# Altium project FlightControlBoard.PrjPcb
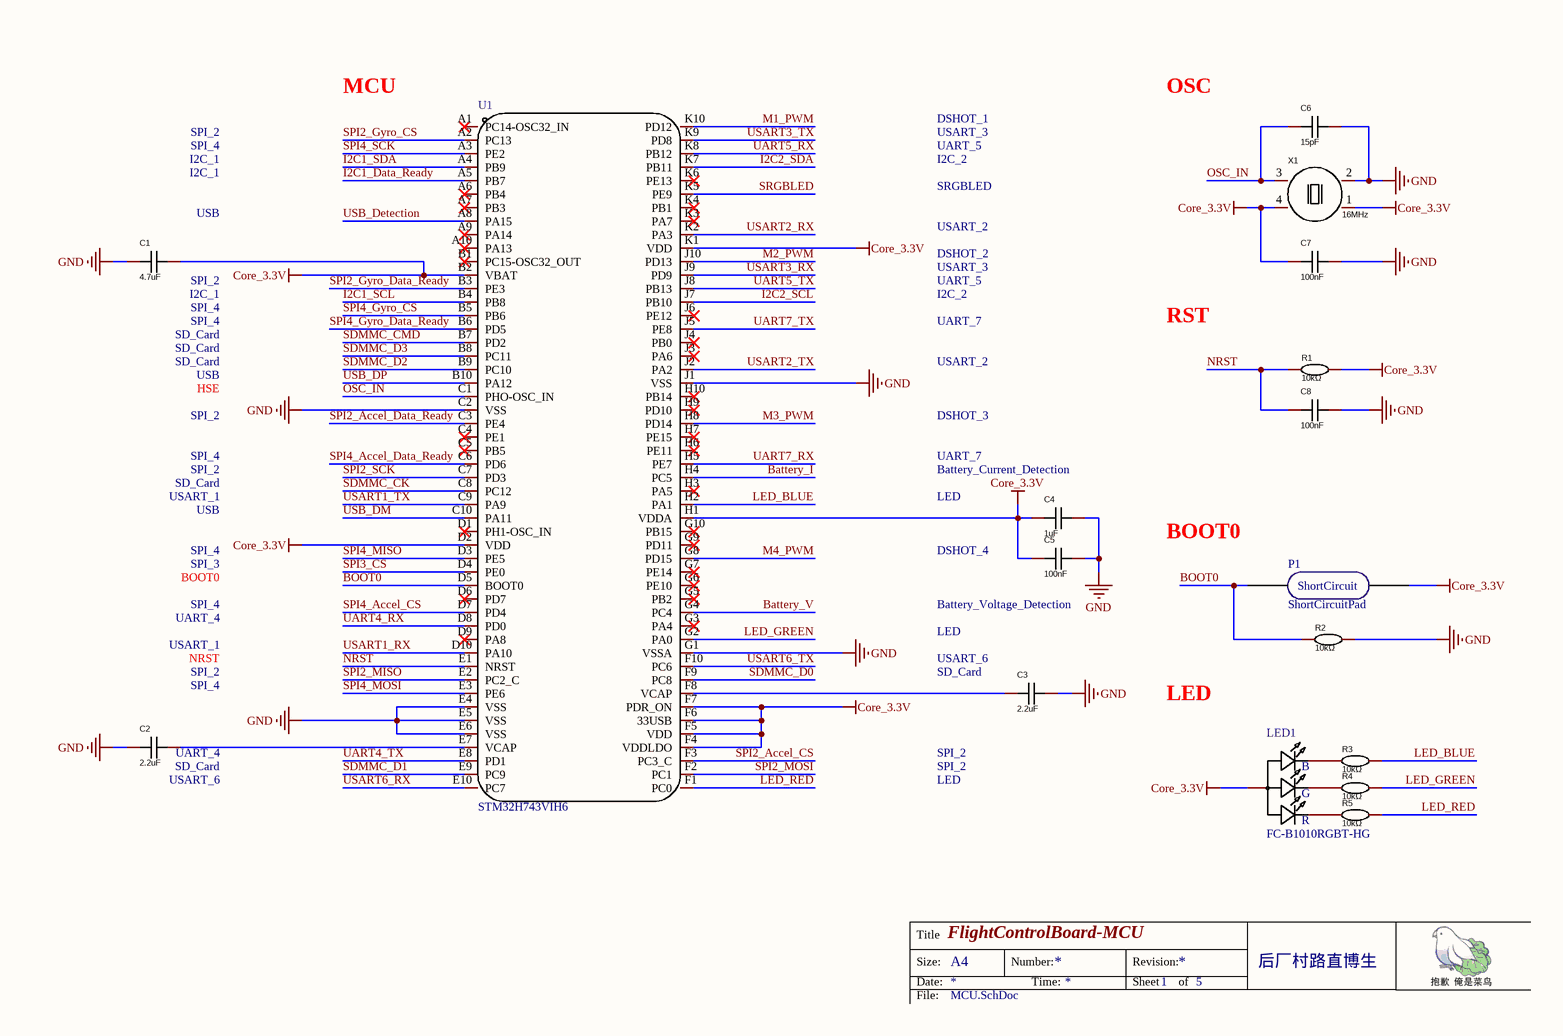
[diagram p0: MCU.SchDoc]
5 sheets, 249 parts. Net scope: global (net labels, ports and power ports of the same name join across sheets).
Board file: FlightControlBoard.PcbDoc
Sheets:
  MCU.SchDoc
  ESC.SchDoc
  Peripheral.SchDoc
  Power.SchDoc
  Interface.SchDoc

## Sheet MCU.SchDoc: FlightControlBoard-MCU
size A4; SheetNumber: 1; SheetTotal: 5

### Parts
C1  4.7uF  [C0402]
C2  2.2uF  [C0402]
C3  2.2uF  [C0402]
C4  1uF  [C0201]
C5  100nF  [C0201]
C6  15pF  [C0201]
C7  100nF  [C0201]
C8  100nF  [C0201]
LED1  FC-B1010RGBT-HG  [LED-ARRAY-SMD_4P-L1.0-W1.0-TR-RD]
P1  ShortCircuitPad  [ShortCircuitPad]
R1  10kΩ  [R0201]
R2  10kΩ  [R0201]
R3  10kΩ  [R0201]
R4  10kΩ  [R0201]
R5  10kΩ  [R0201]
U1  STM32H743VIH6  [BGA-100_L8.0-W8.0-P0.80-R10-C10-BL]
X1  value 16MHz  [OSC-SMD_4P-L2.5-W2.0-BL]  (hidden comment: X1G004171002700)

### Nets
Core_3.3V: C1.1 C4.2 C5.2 C7.2 LED1.1(+) P1.2 R1.2 U1.A8(PA15) U1.B2(VBAT) U1.D2(VDD) U1.F4(VDDLDO) U1.F5(VDD) U1.F6(33USB) U1.F7(PDR_ON) U1.H1(VDDA) U1.K1(VDD) X1.1(/ST) X1.4(VDD)  [also labelled USB_Detection]
GND: C1.2 C2.2 C3.1 C4.1 C5.1 C6.1 C7.1 C8.1 R2.2 U1.C2(VSS) U1.E4(VSS) U1.E5(VSS) U1.E6(VSS) U1.G1(VSSA) U1.J1(VSS) X1.2(GND)
Battery_I: U1.H4(PC5)
Battery_V: U1.G4(PC4)
BOOT0: P1.1 R2.1 U1.D5(BOOT0)
I2C1_Data_Ready: U1.A5(PB7)
I2C1_SCL: U1.B4(PB8)
I2C1_SDA: U1.A4(PB9)
I2C2_SCL: U1.J7(PB10)
I2C2_SDA: U1.K7(PB11)
LED_BLUE: R3.2 U1.H2(PA1)
LED_GREEN: R4.2 U1.G2(PA0)
LED_RED: R5.2 U1.F1(PC0)
M1_PWM: U1.K10(PD12)
M2_PWM: U1.J10(PD13)
M3_PWM: U1.H8(PD14)
M4_PWM: U1.G8(PD15)
NRST: C8.2 R1.1 U1.E1(NRST)
OSC_IN: C6.2 U1.C1(PHO-OSC_IN) X1.3(OUT)
SDMMC_CK: U1.C8(PC12)
SDMMC_CMD: U1.B7(PD2)
SDMMC_D0: U1.F9(PC8)
SDMMC_D1: U1.E9(PC9)
SDMMC_D2: U1.B9(PC10)
SDMMC_D3: U1.B8(PC11)
SPI2_Accel_CS: U1.F3(PC3_C)
SPI2_Accel_Data_Ready: U1.C3(PE4)
SPI2_Gyro_CS: U1.A2(PC13)
SPI2_Gyro_Data_Ready: U1.B3(PE3)
SPI2_MISO: U1.E2(PC2_C)
SPI2_MOSI: U1.F2(PC1)
SPI2_SCK: U1.C7(PD3)
SPI3_CS: U1.D4(PE0)
SPI4_Accel_CS: U1.D7(PD4)
SPI4_Accel_Data_Ready: U1.C6(PD6)
SPI4_Gyro_CS: U1.B5(PB6)
SPI4_Gyro_Data_Ready: U1.B6(PD5)
SPI4_MISO: U1.D3(PE5)
SPI4_MOSI: U1.E3(PE6)
SPI4_SCK: U1.A3(PE2)
SRGBLED: U1.K5(PE9)
UART4_RX: U1.D8(PD0)
UART4_TX: U1.E8(PD1)
UART5_RX: U1.K8(PB12)
UART5_TX: U1.J8(PB13)
UART7_RX: U1.H5(PE7)
UART7_TX: U1.J5(PE8)
USART1_RX: U1.D10(PA10)
USART1_TX: U1.C9(PA9)
USART2_RX: U1.K2(PA3)
USART2_TX: U1.J2(PA2)
USART3_RX: U1.J9(PD9)
USART3_TX: U1.K9(PD8)
USART6_RX: U1.E10(PC7)
USART6_TX: U1.F10(PC6)
USB_DM: U1.C10(PA11)
USB_DP: U1.B10(PA12)
NetC2_1: C2.1 U1.E7(VCAP)
NetC3_2: C3.2 U1.F8(VCAP)
NetLED1_2: LED1.2(-) R5.1
NetLED1_3: LED1.3(-) R4.1
NetLED1_4: LED1.4(-) R3.1

Not connected (* = marked no-connect by the designer): U1 A1(PC14-OSC32_IN)* A6(PB4)* A7(PB3)* A9(PA14)* A10(PA13)* B1(PC15-OSC32_OUT)* C4(PE1)* C5(PB5)* D1(PH1-OSC_IN)* D6(PD7)* D9(PA8)* G3(PA4)* G5(PB2)* G6(PE10)* G7(PE14)* G9(PD11)* G10(PB15)* H3(PA5)* H6(PE11)* H7(PE15)* H9(PD10)* H10(PB14)* J3(PA6)* J4(PB0)* J6(PE12)* K3(PA7)* K4(PB1)* K6(PE13)*

### Notes on the sheet
- MCU
- OSC
- I2C_1
- SPI_2
- SPI_4
- I2C_2
- UART_5
- USART_3
- DSHOT_1
- USB
- USART_2
- SRGBLED
- (near C1) SPI_2
- (near C1) SPI_4
- (near C1) I2C_1
- DSHOT_2
- SD_Card
- UART_7
- RST
- HSE
- DSHOT_3
- USART_1
- (near C4) Battery_Current_Detection
- LED
- SPI_3
- BOOT0
- DSHOT_4
- UART_4
- (near C5) Battery_Voltage_Detection
- NRST
- (near C3) SD_Card
- (near C3) USART_6
- (near C2) SD_Card
- (near C2) UART_4
- (near C2) USART_6
- Title
- Size:
- Date:
- A4
- Number:
- Time:
- Revision:
- Sheet
- of
- 后厂村路直博生
- File:
- (in symbol FC-B1010RGBT-HG) B; G; R
- (in symbol ShortCircuitPad) ShortCircuit

### Library data of the parts
C1-C8 = CC0603KRX7R9BB104: Add into BOM: yes; Convert to PCB: yes
  C1: Value: 4.7uF
  C2 C3: Value: 2.2uF
  C4: Value: 1uF
  C5 C7 C8: Value: 100nF
  C6: Value: 15pF
LED1 = FC-B1010RGBT-HG: Manufacturer: 国星光电; Add into BOM: yes; Emitted Color: RGB三色; Name: FC-B1010RGBT-HG; Symbol: FC-B1010RGBT-HG; Device: FC-B1010RGBT-HG; LCSC Part Name: RGB三色 1010RGB   金线; Supplier Part: C158099; Manufacturer Part: FC-B1010RGBT-HG; Supplier Footprint: 0404; JLCPCB Part Class: Extended Part; Datasheet: https://atta.szlcsc.com/upload/public/pdf/source/20200910/C158099_0C805F16310A4C6DB0163E8F613FF382.pdf; Supplier: LCSC; Convert to PCB: yes
R1-R5 = 0603WAF1002T5E: Add into BOM: yes; Name: 10kΩ; Convert to PCB: yes; Value: 10kΩ
U1 = STM32H743VIH6: Manufacturer: ST(意法半导体); Add into BOM: yes; Name: STM32H743VIH6; Symbol: STM32H743VIH6; Device: STM32H743VIH6; LCSC Part Name: STM32H743VIH6; Supplier Part: C964146; Manufacturer Part: STM32H743VIH6; Supplier Footprint: TFBGA-100; JLCPCB Part Class: Extended Part; Datasheet: https://atta.szlcsc.com/upload/public/pdf/source/20220307/46489B78091107FB73FE6602EFA9948C.pdf; Supplier: LCSC; Convert to PCB: yes
X1 = X1G004171002700: Manufacturer: EPSON(爱普生); Add into BOM: yes; Supply Voltage: 1.6V~3.6V; Name: 16MHz; Symbol: X1G004171002700; Device: X1G004171002700; LCSC Part Name: 16MHz 1.6V~3.6V; Supplier Part: C255993; Manufacturer Part: X1G004171002700; Supplier Footprint: SMD2520-4P; JLCPCB Part Class: Extended Part; Datasheet: https://atta.szlcsc.com/upload/public/pdf/source/20180822/C255993_0296D9A145EF52AA9737C084400D904D.pdf; Supplier: LCSC; Convert to PCB: yes; Operating Temperature: -40℃~+85℃

## Sheet ESC.SchDoc: FlightControlBoard-ESC
size A3; SheetNumber: 2; SheetTotal: 5
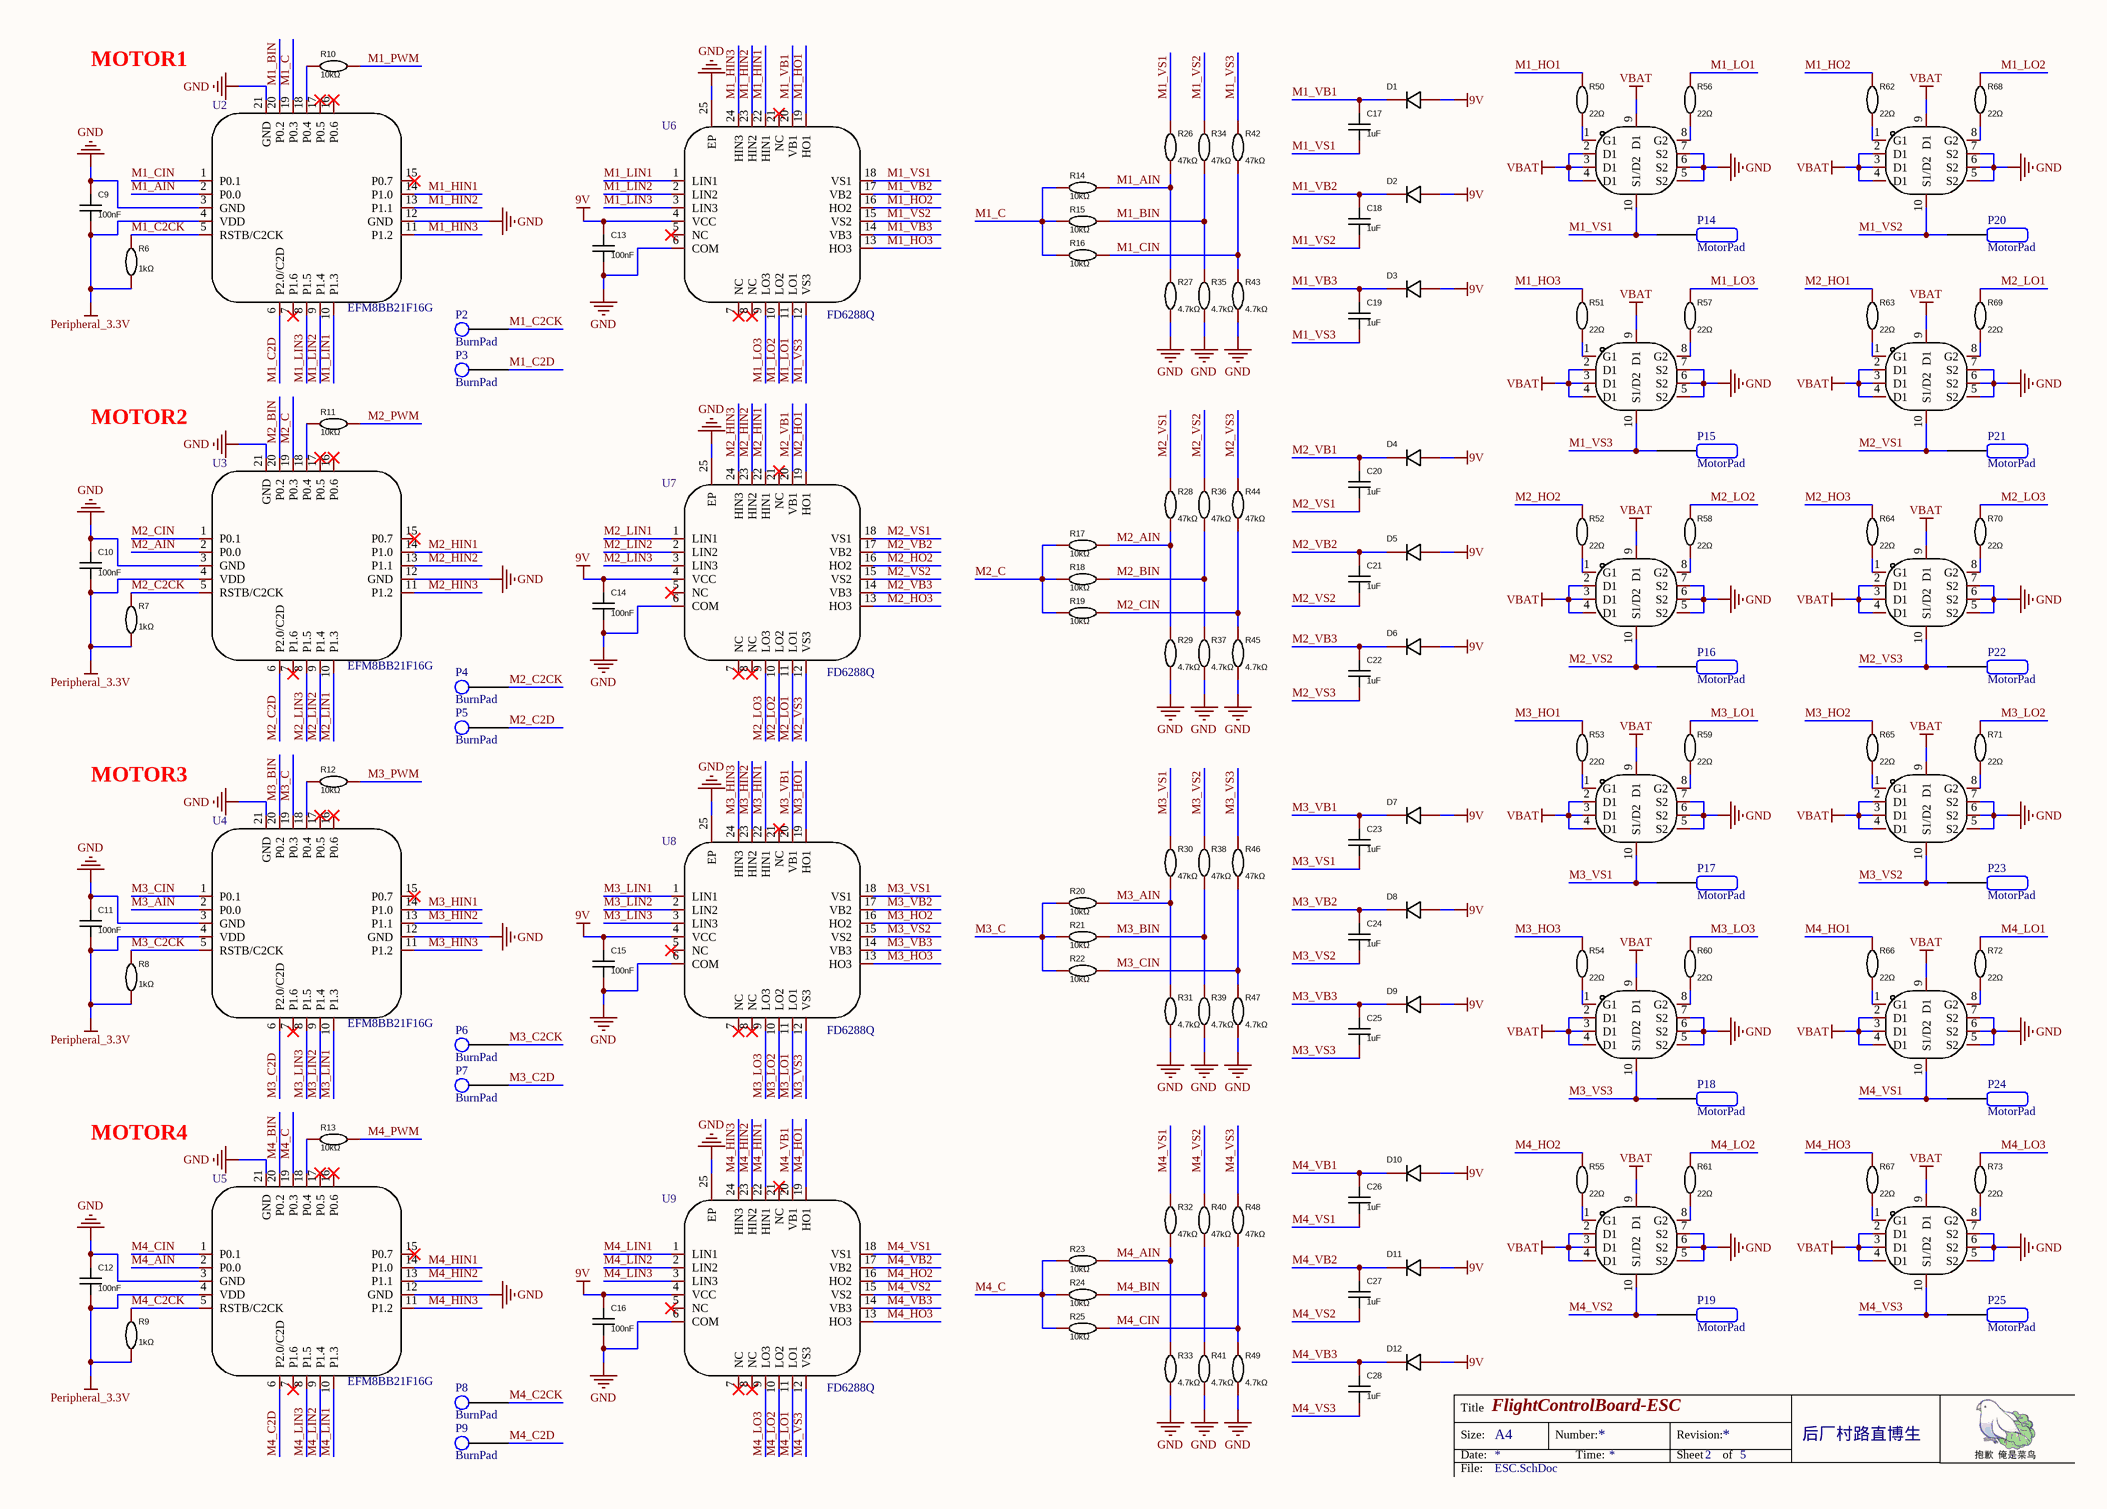
[diagram p1: ESC.SchDoc]

### Parts
C9  100nF  [C0201]
C10  100nF  [C0201]
C11  100nF  [C0201]
C12  100nF  [C0201]
C13  100nF  [C0201]
C14  100nF  [C0201]
C15  100nF  [C0201]
C16  100nF  [C0201]
C17  1uF  [C0402]
C18  1uF  [C0402]
C19  1uF  [C0402]
C20  1uF  [C0402]
C21  1uF  [C0402]
C22  1uF  [C0402]
C23  1uF  [C0402]
C24  1uF  [C0402]
C25  1uF  [C0402]
C26  1uF  [C0402]
C27  1uF  [C0402]
C28  1uF  [C0402]
D1  1N4148WT T4  [SOD-523]  (value not drawn)
D2  1N4148WT T4  [SOD-523]  (value not drawn)
D3  1N4148WT T4  [SOD-523]  (value not drawn)
D4  1N4148WT T4  [SOD-523]  (value not drawn)
D5  1N4148WT T4  [SOD-523]  (value not drawn)
D6  1N4148WT T4  [SOD-523]  (value not drawn)
D7  1N4148WT T4  [SOD-523]  (value not drawn)
D8  1N4148WT T4  [SOD-523]  (value not drawn)
D9  1N4148WT T4  [SOD-523]  (value not drawn)
D10  1N4148WT T4  [SOD-523]  (value not drawn)
D11  1N4148WT T4  [SOD-523]  (value not drawn)
D12  1N4148WT T4  [SOD-523]  (value not drawn)
P2  BurnPad  [BurnPad_0.5mm]
P3  BurnPad  [BurnPad_0.5mm]
P4  BurnPad  [BurnPad_0.5mm]
P5  BurnPad  [BurnPad_0.5mm]
P6  BurnPad  [BurnPad_0.5mm]
P7  BurnPad  [BurnPad_0.5mm]
P8  BurnPad  [BurnPad_0.5mm]
P9  BurnPad  [BurnPad_0.5mm]
P14  MotorPad  [MOTOR HALF HOLE]
P15  MotorPad  [MOTOR HALF HOLE]
P16  MotorPad  [MOTOR HALF HOLE]
P17  MotorPad  [MOTOR HALF HOLE]
P18  MotorPad  [MOTOR HALF HOLE]
P19  MotorPad  [MOTOR HALF HOLE]
P20  MotorPad  [MOTOR HALF HOLE]
P21  MotorPad  [MOTOR HALF HOLE]
P22  MotorPad  [MOTOR HALF HOLE]
P23  MotorPad  [MOTOR HALF HOLE]
P24  MotorPad  [MOTOR HALF HOLE]
P25  MotorPad  [MOTOR HALF HOLE]
Q1  AON7934  [DFN-8]  (value not drawn)
Q2  AON7934  [DFN-8]  (value not drawn)
Q3  AON7934  [DFN-8]  (value not drawn)
Q4  AON7934  [DFN-8]  (value not drawn)
Q5  AON7934  [DFN-8]  (value not drawn)
Q6  AON7934  [DFN-8]  (value not drawn)
Q7  AON7934  [DFN-8]  (value not drawn)
Q8  AON7934  [DFN-8]  (value not drawn)
Q9  AON7934  [DFN-8]  (value not drawn)
Q10  AON7934  [DFN-8]  (value not drawn)
Q11  AON7934  [DFN-8]  (value not drawn)
Q12  AON7934  [DFN-8]  (value not drawn)
R6  1kΩ  [R0201]
R7  1kΩ  [R0201]
R8  1kΩ  [R0201]
R9  1kΩ  [R0201]
R10  10kΩ  [R0201]
R11  10kΩ  [R0201]
R12  10kΩ  [R0201]
R13  10kΩ  [R0201]
R14  10kΩ  [R0201]
R15  10kΩ  [R0201]
R16  10kΩ  [R0201]
R17  10kΩ  [R0201]
R18  10kΩ  [R0201]
R19  10kΩ  [R0201]
R20  10kΩ  [R0201]
R21  10kΩ  [R0201]
R22  10kΩ  [R0201]
R23  10kΩ  [R0201]
R24  10kΩ  [R0201]
R25  10kΩ  [R0201]
R26  47kΩ  [R0201]
R27  4.7kΩ  [R0201]
R28  47kΩ  [R0201]
R29  4.7kΩ  [R0201]
R30  47kΩ  [R0201]
R31  4.7kΩ  [R0201]
R32  47kΩ  [R0201]
R33  4.7kΩ  [R0201]
R34  47kΩ  [R0201]
R35  4.7kΩ  [R0201]
R36  47kΩ  [R0201]
R37  4.7kΩ  [R0201]
R38  47kΩ  [R0201]
R39  4.7kΩ  [R0201]
R40  47kΩ  [R0201]
R41  4.7kΩ  [R0201]
R42  47kΩ  [R0201]
R43  4.7kΩ  [R0201]
R44  47kΩ  [R0201]
R45  4.7kΩ  [R0201]
R46  47kΩ  [R0201]
R47  4.7kΩ  [R0201]
R48  47kΩ  [R0201]
R49  4.7kΩ  [R0201]
R50  22Ω  [R0201]
R51  22Ω  [R0201]
R52  22Ω  [R0201]
R53  22Ω  [R0201]
R54  22Ω  [R0201]
R55  22Ω  [R0201]
R56  22Ω  [R0201]
R57  22Ω  [R0201]
R58  22Ω  [R0201]
R59  22Ω  [R0201]
R60  22Ω  [R0201]
R61  22Ω  [R0201]
R62  22Ω  [R0201]
R63  22Ω  [R0201]
R64  22Ω  [R0201]
R65  22Ω  [R0201]
R66  22Ω  [R0201]
R67  22Ω  [R0201]
R68  22Ω  [R0201]
R69  22Ω  [R0201]
R70  22Ω  [R0201]
R71  22Ω  [R0201]
R72  22Ω  [R0201]
R73  22Ω  [R0201]
U2  EFM8BB21F16G  [QFN-20_L3.0-W3.0-P0.50-BL-EP1.7_EFM8BB21F16G]
U3  EFM8BB21F16G  [QFN-20_L3.0-W3.0-P0.50-BL-EP1.7_EFM8BB21F16G]
U4  EFM8BB21F16G  [QFN-20_L3.0-W3.0-P0.50-BL-EP1.7_EFM8BB21F16G]
U5  EFM8BB21F16G  [QFN-20_L3.0-W3.0-P0.50-BL-EP1.7_EFM8BB21F16G]
U6  FD6288Q  [QFN-24_L4.0-W4.0-P0.50-BL-EP2.6]
U7  FD6288Q  [QFN-24_L4.0-W4.0-P0.50-BL-EP2.6]
U8  FD6288Q  [QFN-24_L4.0-W4.0-P0.50-BL-EP2.6]
U9  FD6288Q  [QFN-24_L4.0-W4.0-P0.50-BL-EP2.6]

### Nets
9V: C13.2 C14.2 C15.2 C16.2 D1.2(A) D2.2(A) D3.2(A) D4.2(A) D5.2(A) D6.2(A) D7.2(A) D8.2(A) D9.2(A) D10.2(A) D11.2(A) D12.2(A) U6.4(VCC) U7.4(VCC) U8.4(VCC) U9.4(VCC)
GND: C9.2 C10.2 C11.2 C12.2 C13.1 C14.1 C15.1 C16.1 Q1.5(S2) Q1.6(S2) Q1.7(S2) Q2.5(S2) Q2.6(S2) Q2.7(S2) Q3.5(S2) Q3.6(S2) Q3.7(S2) Q4.5(S2) Q4.6(S2) Q4.7(S2) Q5.5(S2) Q5.6(S2) Q5.7(S2) Q6.5(S2) Q6.6(S2) Q6.7(S2) Q7.5(S2) Q7.6(S2) Q7.7(S2) Q8.5(S2) Q8.6(S2) Q8.7(S2) Q9.5(S2) Q9.6(S2) Q9.7(S2) Q10.5(S2) Q10.6(S2) Q10.7(S2) Q11.5(S2) Q11.6(S2) Q11.7(S2) Q12.5(S2) Q12.6(S2) Q12.7(S2) R27.1 R29.1 R31.1 R33.1 R35.1 R37.1 R39.1 R41.1 R43.1 R45.1 R47.1 R49.1 U2.3(GND) U2.12(GND) U2.21(GND) U3.3(GND) U3.12(GND) U3.21(GND) U4.3(GND) U4.12(GND) U4.21(GND) U5.3(GND) U5.12(GND) U5.21(GND) U6.6(COM) U6.25(EP) U7.6(COM) U7.25(EP) U8.6(COM) U8.25(EP) U9.6(COM) U9.25(EP)
Peripheral_3.3V: C9.1 C10.1 C11.1 C12.1 R6.1 R7.1 R8.1 R9.1 U2.4(VDD) U3.4(VDD) U4.4(VDD) U5.4(VDD)
VBAT: Q1.2(D1) Q1.3(D1) Q1.4(D1) Q1.9(D1) Q2.2(D1) Q2.3(D1) Q2.4(D1) Q2.9(D1) Q3.2(D1) Q3.3(D1) Q3.4(D1) Q3.9(D1) Q4.2(D1) Q4.3(D1) Q4.4(D1) Q4.9(D1) Q5.2(D1) Q5.3(D1) Q5.4(D1) Q5.9(D1) Q6.2(D1) Q6.3(D1) Q6.4(D1) Q6.9(D1) Q7.2(D1) Q7.3(D1) Q7.4(D1) Q7.9(D1) Q8.2(D1) Q8.3(D1) Q8.4(D1) Q8.9(D1) Q9.2(D1) Q9.3(D1) Q9.4(D1) Q9.9(D1) Q10.2(D1) Q10.3(D1) Q10.4(D1) Q10.9(D1) Q11.2(D1) Q11.3(D1) Q11.4(D1) Q11.9(D1) Q12.2(D1) Q12.3(D1) Q12.4(D1) Q12.9(D1)
M1_AIN: R14.2 R26.1 R27.2 U2.2(P0.0)
M1_BIN: R15.2 R34.1 R35.2 U2.20(P0.2)
M1_C: R14.1 R15.1 R16.1 U2.19(P0.3)
M1_C2CK: P2.1 R6.2 U2.5(RSTB/C2CK)
M1_C2D: P3.1 U2.6(P2.0/C2D)
M1_CIN: R16.2 R42.1 R43.2 U2.1(P0.1)
M1_HIN1: U2.14(P1.0) U6.22(HIN1)
M1_HIN2: U2.13(P1.1) U6.23(HIN2)
M1_HIN3: U2.11(P1.2) U6.24(HIN3)
M1_HO1: R50.2 U6.19(HO1)
M1_HO2: R62.2 U6.16(HO2)
M1_HO3: R51.2 U6.13(HO3)
M1_LIN1: U2.10(P1.3) U6.1(LIN1)
M1_LIN2: U2.9(P1.4) U6.2(LIN2)
M1_LIN3: U2.8(P1.5) U6.3(LIN3)
M1_LO1: R56.2 U6.11(LO1)
M1_LO2: R68.2 U6.10(LO2)
M1_LO3: R57.2 U6.9(LO3)
M1_PWM: R10.2
M1_VB1: C17.2 D1.1(K) U6.20(VB1)
M1_VB2: C18.2 D2.1(K) U6.17(VB2)
M1_VB3: C19.2 D3.1(K) U6.14(VB3)
M1_VS1: C17.1 P14.1 Q1.10(S1/D2) R26.2 U6.18(VS1)
M1_VS2: C18.1 P20.1 Q7.10(S1/D2) R34.2 U6.15(VS2)
M1_VS3: C19.1 P15.1 Q2.10(S1/D2) R42.2 U6.12(VS3)
M2_AIN: R17.2 R28.1 R29.2 U3.2(P0.0)
M2_BIN: R18.2 R36.1 R37.2 U3.20(P0.2)
M2_C: R17.1 R18.1 R19.1 U3.19(P0.3)
M2_C2CK: P4.1 R7.2 U3.5(RSTB/C2CK)
M2_C2D: P5.1 U3.6(P2.0/C2D)
M2_CIN: R19.2 R44.1 R45.2 U3.1(P0.1)
M2_HIN1: U3.14(P1.0) U7.22(HIN1)
M2_HIN2: U3.13(P1.1) U7.23(HIN2)
M2_HIN3: U3.11(P1.2) U7.24(HIN3)
M2_HO1: R63.2 U7.19(HO1)
M2_HO2: R52.2 U7.16(HO2)
M2_HO3: R64.2 U7.13(HO3)
M2_LIN1: U3.10(P1.3) U7.1(LIN1)
M2_LIN2: U3.9(P1.4) U7.2(LIN2)
M2_LIN3: U3.8(P1.5) U7.3(LIN3)
M2_LO1: R69.2 U7.11(LO1)
M2_LO2: R58.2 U7.10(LO2)
M2_LO3: R70.2 U7.9(LO3)
M2_PWM: R11.2
M2_VB1: C20.2 D4.1(K) U7.20(VB1)
M2_VB2: C21.2 D5.1(K) U7.17(VB2)
M2_VB3: C22.2 D6.1(K) U7.14(VB3)
M2_VS1: C20.1 P21.1 Q8.10(S1/D2) R28.2 U7.18(VS1)
M2_VS2: C21.1 P16.1 Q3.10(S1/D2) R36.2 U7.15(VS2)
M2_VS3: C22.1 P22.1 Q9.10(S1/D2) R44.2 U7.12(VS3)
M3_AIN: R20.2 R30.1 R31.2 U4.2(P0.0)
M3_BIN: R21.2 R38.1 R39.2 U4.20(P0.2)
M3_C: R20.1 R21.1 R22.1 U4.19(P0.3)
M3_C2CK: P6.1 R8.2 U4.5(RSTB/C2CK)
M3_C2D: P7.1 U4.6(P2.0/C2D)
M3_CIN: R22.2 R46.1 R47.2 U4.1(P0.1)
M3_HIN1: U4.14(P1.0) U8.22(HIN1)
M3_HIN2: U4.13(P1.1) U8.23(HIN2)
M3_HIN3: U4.11(P1.2) U8.24(HIN3)
M3_HO1: R53.2 U8.19(HO1)
M3_HO2: R65.2 U8.16(HO2)
M3_HO3: R54.2 U8.13(HO3)
M3_LIN1: U4.10(P1.3) U8.1(LIN1)
M3_LIN2: U4.9(P1.4) U8.2(LIN2)
M3_LIN3: U4.8(P1.5) U8.3(LIN3)
M3_LO1: R59.2 U8.11(LO1)
M3_LO2: R71.2 U8.10(LO2)
M3_LO3: R60.2 U8.9(LO3)
M3_PWM: R12.2
M3_VB1: C23.2 D7.1(K) U8.20(VB1)
M3_VB2: C24.2 D8.1(K) U8.17(VB2)
M3_VB3: C25.2 D9.1(K) U8.14(VB3)
M3_VS1: C23.1 P17.1 Q4.10(S1/D2) R30.2 U8.18(VS1)
M3_VS2: C24.1 P23.1 Q10.10(S1/D2) R38.2 U8.15(VS2)
M3_VS3: C25.1 P18.1 Q5.10(S1/D2) R46.2 U8.12(VS3)
M4_AIN: R23.2 R32.1 R33.2 U5.2(P0.0)
M4_BIN: R24.2 R40.1 R41.2 U5.20(P0.2)
M4_C: R23.1 R24.1 R25.1 U5.19(P0.3)
M4_C2CK: P8.1 R9.2 U5.5(RSTB/C2CK)
M4_C2D: P9.1 U5.6(P2.0/C2D)
M4_CIN: R25.2 R48.1 R49.2 U5.1(P0.1)
M4_HIN1: U5.14(P1.0) U9.22(HIN1)
M4_HIN2: U5.13(P1.1) U9.23(HIN2)
M4_HIN3: U5.11(P1.2) U9.24(HIN3)
M4_HO1: R66.2 U9.19(HO1)
M4_HO2: R55.2 U9.16(HO2)
M4_HO3: R67.2 U9.13(HO3)
M4_LIN1: U5.10(P1.3) U9.1(LIN1)
M4_LIN2: U5.9(P1.4) U9.2(LIN2)
M4_LIN3: U5.8(P1.5) U9.3(LIN3)
M4_LO1: R72.2 U9.11(LO1)
M4_LO2: R61.2 U9.10(LO2)
M4_LO3: R73.2 U9.9(LO3)
M4_PWM: R13.2
M4_VB1: C26.2 D10.1(K) U9.20(VB1)
M4_VB2: C27.2 D11.1(K) U9.17(VB2)
M4_VB3: C28.2 D12.1(K) U9.14(VB3)
M4_VS1: C26.1 P24.1 Q11.10(S1/D2) R32.2 U9.18(VS1)
M4_VS2: C27.1 P19.1 Q6.10(S1/D2) R40.2 U9.15(VS2)
M4_VS3: C28.1 P25.1 Q12.10(S1/D2) R48.2 U9.12(VS3)
NetQ1_1: Q1.1(G1) R50.1
NetQ1_8: Q1.8(G2) R56.1
NetQ2_1: Q2.1(G1) R51.1
NetQ2_8: Q2.8(G2) R57.1
NetQ3_1: Q3.1(G1) R52.1
NetQ3_8: Q3.8(G2) R58.1
NetQ4_1: Q4.1(G1) R53.1
NetQ4_8: Q4.8(G2) R59.1
NetQ5_1: Q5.1(G1) R54.1
NetQ5_8: Q5.8(G2) R60.1
NetQ6_1: Q6.1(G1) R55.1
NetQ6_8: Q6.8(G2) R61.1
NetQ7_1: Q7.1(G1) R62.1
NetQ7_8: Q7.8(G2) R68.1
NetQ8_1: Q8.1(G1) R63.1
NetQ8_8: Q8.8(G2) R69.1
NetQ9_1: Q9.1(G1) R64.1
NetQ9_8: Q9.8(G2) R70.1
NetQ10_1: Q10.1(G1) R65.1
NetQ10_8: Q10.8(G2) R71.1
NetQ11_1: Q11.1(G1) R66.1
NetQ11_8: Q11.8(G2) R72.1
NetQ12_1: Q12.1(G1) R67.1
NetQ12_8: Q12.8(G2) R73.1
NetR10_1: R10.1 U2.18(P0.4)
NetR11_1: R11.1 U3.18(P0.4)
NetR12_1: R12.1 U4.18(P0.4)
NetR13_1: R13.1 U5.18(P0.4)

Not connected (* = marked no-connect by the designer): U2 7(P1.6)* 15(P0.7)* 16(P0.6)* 17(P0.5)*; U3 7(P1.6)* 15(P0.7)* 16(P0.6)* 17(P0.5)*; U4 7(P1.6)* 15(P0.7)* 16(P0.6)* 17(P0.5)*; U5 7(P1.6)* 15(P0.7)* 16(P0.6)* 17(P0.5)*; U6 5(NC)* 7(NC)* 8(NC)* 21(NC)*; U7 5(NC)* 7(NC)* 8(NC)* 21(NC)*; U8 5(NC)* 7(NC)* 8(NC)* 21(NC)*; U9 5(NC)* 7(NC)* 8(NC)* 21(NC)*

### Notes on the sheet
- MOTOR1
- MOTOR2
- MOTOR3
- MOTOR4
- Title
- Size:
- Date:
- A4
- Number:
- Time:
- Revision:
- Sheet
- of
- 后厂村路直博生
- File:

### Library data of the parts
C9-C28 = CC0603KRX7R9BB104: Add into BOM: yes; Convert to PCB: yes
  C9-C16: Name: 100nF; Value: 100nF
  C17-C28: Name: 1uF; Value: 1uF
D1-D12 = 1N4148WT T4: Manufacturer: CJ(江苏长电/长晶); Symbol: 1N4148WT_C68948; Add into BOM: yes; Diode Configuration: 独立式; Power Dissipation: 150mW; Reverse Voltage (Vr): 75V; Average Rectified Current (Io): 150mA; Forward Voltage (Vf@If): 1.25V@150mA; Reverse Leakage Current: 1uA@75V; Reverse Recovery Time (trr): 4ns; Name: 1N4148WT T4; Device: 1N4148WT T4; LCSC Part Name: 75V 150mA 4ns; Supplier Part: C68948; Manufacturer Part: 1N4148WT T4; Supplier Footprint: SOD-523; JLCPCB Part Class: Extended Part; Datasheet: https://atta.szlcsc.com/upload/public/pdf/source/20160516/1463363918425.pdf; Supplier: LCSC; Convert to PCB: yes; Operating Temperature: +150℃@(Tj)
Q1-Q12 = AON7934: Manufacturer: AOS; Add into BOM: yes; Type: 2个N沟道; Drain Source Voltage (Vdss): 30V; Continuous Drain Current (Id): 13A；15A; Power Dissipation (Pd): 2.5W; Drain Source On Resistance (RDS(on)@Vgs,Id): 10.2mΩ@13A,10V; Gate Threshold Voltage (Vgs(th)@Id): 2.2V@250uA; Total Gate Charge (Qg@Vgs): 11nC@10V; Input Capacitance (Ciss@Vds): 485pF@15V; Name: AON7934; Symbol: AON7934; Device: AON7934; LCSC Part Name: 2个N沟道 耐压:30V 电流:13A 电流:15A; Supplier Part: C485677; Manufacturer Part: AON7934; Supplier Footprint: DFN-8(3x3); JLCPCB Part Class: Extended Part; Datasheet: https://atta.szlcsc.com/upload/public/pdf/source/20200117/C485677_FDAB9B95CAD5785C045586C81566DB43.pdf; Supplier: LCSC; Convert to PCB: yes; Reverse Transfer Capacitance (Crss@Vds): -; Operating Temperature: -55℃~+150℃@(Tj)
R6-R73 = 0603WAF1002T5E: Add into BOM: yes; Convert to PCB: yes
  R6-R9: Name: 1kΩ; Value: 1kΩ
  R10-R25: Name: 10kΩ; Value: 10kΩ
  R26 R28 R30 R32 R34 R36 R38 R40 R42 R44 R46 R48: Name: 47kΩ; Value: 47kΩ
  R27 R29 R31 R33 R35 R37 R39 R41 R43 R45 R47 R49: Name: 4.7kΩ; Value: 4.7kΩ
  R50-R73: Name: 22Ω; Value: 22Ω
U2-U5 = EFM8BB21F16G: Manufacturer: SILICON LABS(芯科); Name: EFM8BB21F16G-C-QFN20R; Symbol: EFM8BB21F16G-C-QFN20; Add into BOM: yes; CPU Core: 51系列; CPU Maximum Speed: 50MHz; Operating Voltage Range: 2.2V~3.6V; Program Storage Size: 16KB; Program Memory Type: FLASH; RAM Size: 2.25KB; GPIO Ports Number: 16; ADC (Bit): 12bit; Peripheral/Function: 看门狗；PWM; Internal Oscillator: 有; Device: EFM8BB21F16G-C-QFN20R; LCSC Part Name: 51系列 50MHz; Supplier Part: C80713; Manufacturer Part: EFM8BB21F16G-C-QFN20R; Supplier Footprint: QFN-20-EP(3x3); JLCPCB Part Class: Extended Part; Datasheet: https://atta.szlcsc.com/upload/public/pdf/source/20160823/1471947533781.pdf; Supplier: LCSC; Convert to PCB: yes; EEPROM: -; DAC (Bit): -; PWM (Bit): -; Universal Serial Bus: -; Internal Comparator: -; communication protocol: -; Watchdog: -; Real-Time Clock: -; Infrared Data Association: -; Low-Voltage Detect: -; CCP Capture/Compare: -; Secure Digital Input and Output: -; Direct Memory Access: -; Operating Temperature Range: -40℃~+85℃
U6-U9 = FD6288Q: Manufacturer: Fortior Tech(峰岹); Symbol: FD6288Q_C328453; Add into BOM: yes; Name: FD6288Q; Device: FD6288Q; LCSC Part Name: FD6288Q; Supplier Part: C328453; Manufacturer Part: FD6288Q; Supplier Footprint: QFN-24-EP(4x4); JLCPCB Part Class: Extended Part; Datasheet: https://atta.szlcsc.com/upload/public/pdf/source/20181108/C328453_785547738DB9FC0123219FC22539EFAD.pdf; Supplier: LCSC; Convert to PCB: yes

## Sheet Peripheral.SchDoc: FlightControlBoard-Peripheral
size A4; SheetNumber: 3; SheetTotal: 5
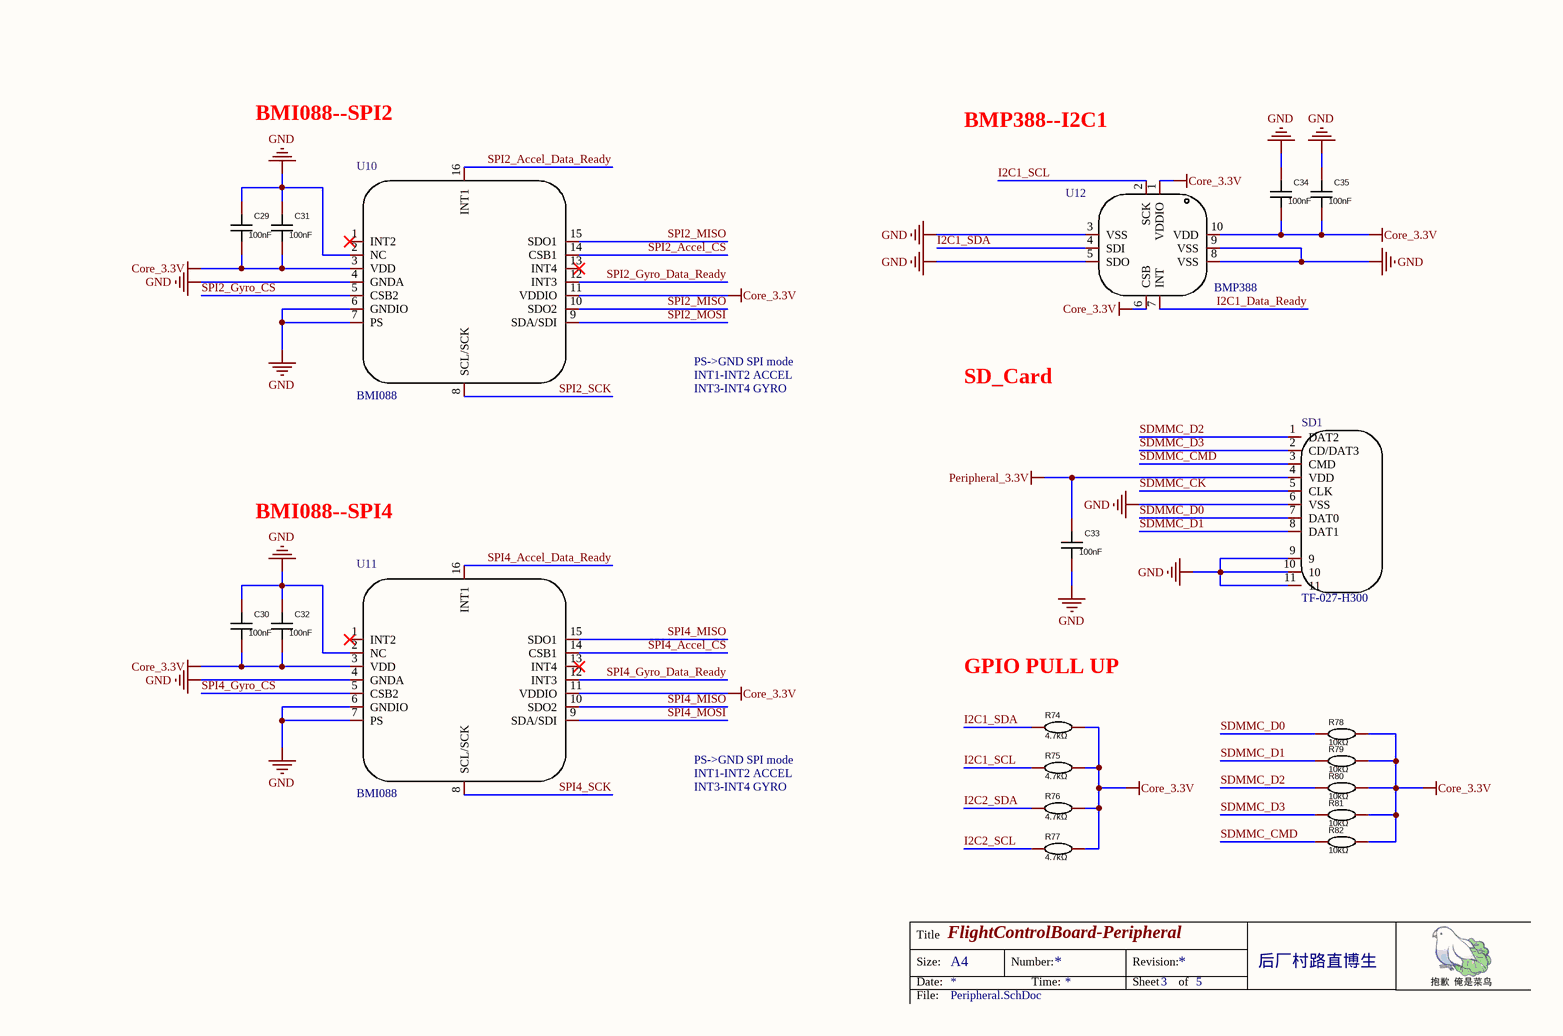
[diagram p2: Peripheral.SchDoc]

### Parts
C29  100nF  [C0201]
C30  100nF  [C0201]
C31  100nF  [C0201]
C32  100nF  [C0201]
C33  100nF  [C0201]
C34  100nF  [C0201]
C35  100nF  [C0201]
R74  4.7kΩ  [R0201]
R75  4.7kΩ  [R0201]
R76  4.7kΩ  [R0201]
R77  4.7kΩ  [R0201]
R78  10kΩ  [R0201]
R79  10kΩ  [R0201]
R80  10kΩ  [R0201]
R81  10kΩ  [R0201]
R82  10kΩ  [R0201]
SD1  TF-027-H300  [TF-SMD_HYCW104-TF08-375B]
U10  BMI088  [LGA-16_L4.5-W3.0-P0.50-BL]
U11  BMI088  [LGA-16_L4.5-W3.0-P0.50-BL]
U12  BMP388  [LGA-10]

### Nets
Core_3.3V: C29.1 C30.1 C31.1 C32.1 C34.1 C35.1 R74.2 R75.2 R76.2 R77.2 R78.2 R79.2 R80.2 R81.2 R82.2 U10.3(VDD) U10.11(VDDIO) U11.3(VDD) U11.11(VDDIO) U12.1(VDDIO) U12.6(CSB) U12.10(VDD)
GND: C29.2 C30.2 C31.2 C32.2 C33.1 C34.2 C35.2 SD1.6(VSS) SD1.9 SD1.10 SD1.11 U10.2(NC) U10.4(GNDA) U10.6(GNDIO) U10.7(PS) U11.2(NC) U11.4(GNDA) U11.6(GNDIO) U11.7(PS) U12.3(VSS) U12.5(SDO) U12.8(VSS) U12.9(VSS)
Peripheral_3.3V: C33.2 SD1.4(VDD)
I2C1_Data_Ready: U12.7(INT)
I2C1_SCL: R75.1 U12.2(SCK)
I2C1_SDA: R74.1 U12.4(SDI)
I2C2_SCL: R77.1
I2C2_SDA: R76.1
SDMMC_CK: SD1.5(CLK)
SDMMC_CMD: R82.1 SD1.3(CMD)
SDMMC_D0: R78.1 SD1.7(DAT0)
SDMMC_D1: R79.1 SD1.8(DAT1)
SDMMC_D2: R80.1 SD1.1(DAT2)
SDMMC_D3: R81.1 SD1.2(CD/DAT3)
SPI2_Accel_CS: U10.14(CSB1)
SPI2_Accel_Data_Ready: U10.16(INT1)
SPI2_Gyro_CS: U10.5(CSB2)
SPI2_Gyro_Data_Ready: U10.12(INT3)
SPI2_MISO: U10.10(SDO2) U10.15(SDO1)
SPI2_MOSI: U10.9(SDA/SDI)
SPI2_SCK: U10.8(SCL/SCK)
SPI4_Accel_CS: U11.14(CSB1)
SPI4_Accel_Data_Ready: U11.16(INT1)
SPI4_Gyro_CS: U11.5(CSB2)
SPI4_Gyro_Data_Ready: U11.12(INT3)
SPI4_MISO: U11.10(SDO2) U11.15(SDO1)
SPI4_MOSI: U11.9(SDA/SDI)
SPI4_SCK: U11.8(SCL/SCK)

Not connected (* = marked no-connect by the designer): U10 1(INT2)* 13(INT4)*; U11 1(INT2)* 13(INT4)*

### Notes on the sheet
- BMI088--SPI2
- BMP388--I2C1
- PS->GND SPI mode
- INT1-INT2 ACCEL
- SD_Card
- INT3-INT4 GYRO
- BMI088--SPI4
- (near R74) GPIO PULL UP
- Title
- Size:
- Date:
- A4
- Number:
- Time:
- Revision:
- Sheet
- of
- 后厂村路直博生
- File:

### Library data of the parts
C29-C35 = CC0603KRX7R9BB104: Add into BOM: yes; Name: 100nF; Convert to PCB: yes; Value: 100nF
R74-R82 = 0603WAF1002T5E: Add into BOM: yes; Convert to PCB: yes
  R74-R77: Name: 4.7kΩ; Value: 4.7kΩ
  R78-R82: Name: 10kΩ; Value: 10kΩ
SD1 = TF-027-H300: Manufacturer: HANBO(汉博); Add into BOM: yes; Card Connection Mode: 拔插式; Card Type: MicroSD卡(TF卡); Connector Type: 卡座; Maximum Body Height: 3mm; Symbol: TF-027-H300; Device: TF-027-H300; Supplier: LCSC; Supplier Part: C5310495; Manufacturer Part: TF-027-H300; JLCPCB Part Class: Extended Part; LCSC Part Name: 拔插式 MicroSD卡(TF卡) 卡座; Supplier Footprint: SMD; Datasheet: https://atta.szlcsc.com/upload/public/pdf/source/20221209/91D0698AD722546CAE445F87A6450B20.pdf; Convert to PCB: yes; Contact Material: -; Contact Plating: 镀金; Operating Temperature Range: -20℃~+85℃; Welding Temperature (Max): -
U10 U11 = BMI088: Manufacturer: Bosch(博世); Add into BOM: yes; Name: BMI088; Symbol: BMI088; Device: BMI088; LCSC Part Name: BMI088; Supplier Part: C194919; Manufacturer Part: BMI088; Supplier Footprint: LGA-16; JLCPCB Part Class: Extended Part; Datasheet: https://atta.szlcsc.com/upload/public/pdf/source/20180628/C194919_66CCF125FF968C218A4D358C68AC68D6.pdf; Supplier: LCSC; Convert to PCB: yes
U12 = BMP388: Manufacturer: Bosch(博世); Add into BOM: yes; Name: BMP388; Symbol: BMP388; Device: BMP388; LCSC Part Name: BMP388; Supplier Part: C779278; Manufacturer Part: BMP388; Supplier Footprint: LGA-10; JLCPCB Part Class: Extended Part; Datasheet: https://atta.szlcsc.com/upload/public/pdf/source/20211019/91C230A1D32F1E776DA878FFB43C8B15.pdf; Supplier: LCSC; Convert to PCB: yes

## Sheet Power.SchDoc: FlightControlBoard-Power
size A4; SheetNumber: 4; SheetTotal: 5
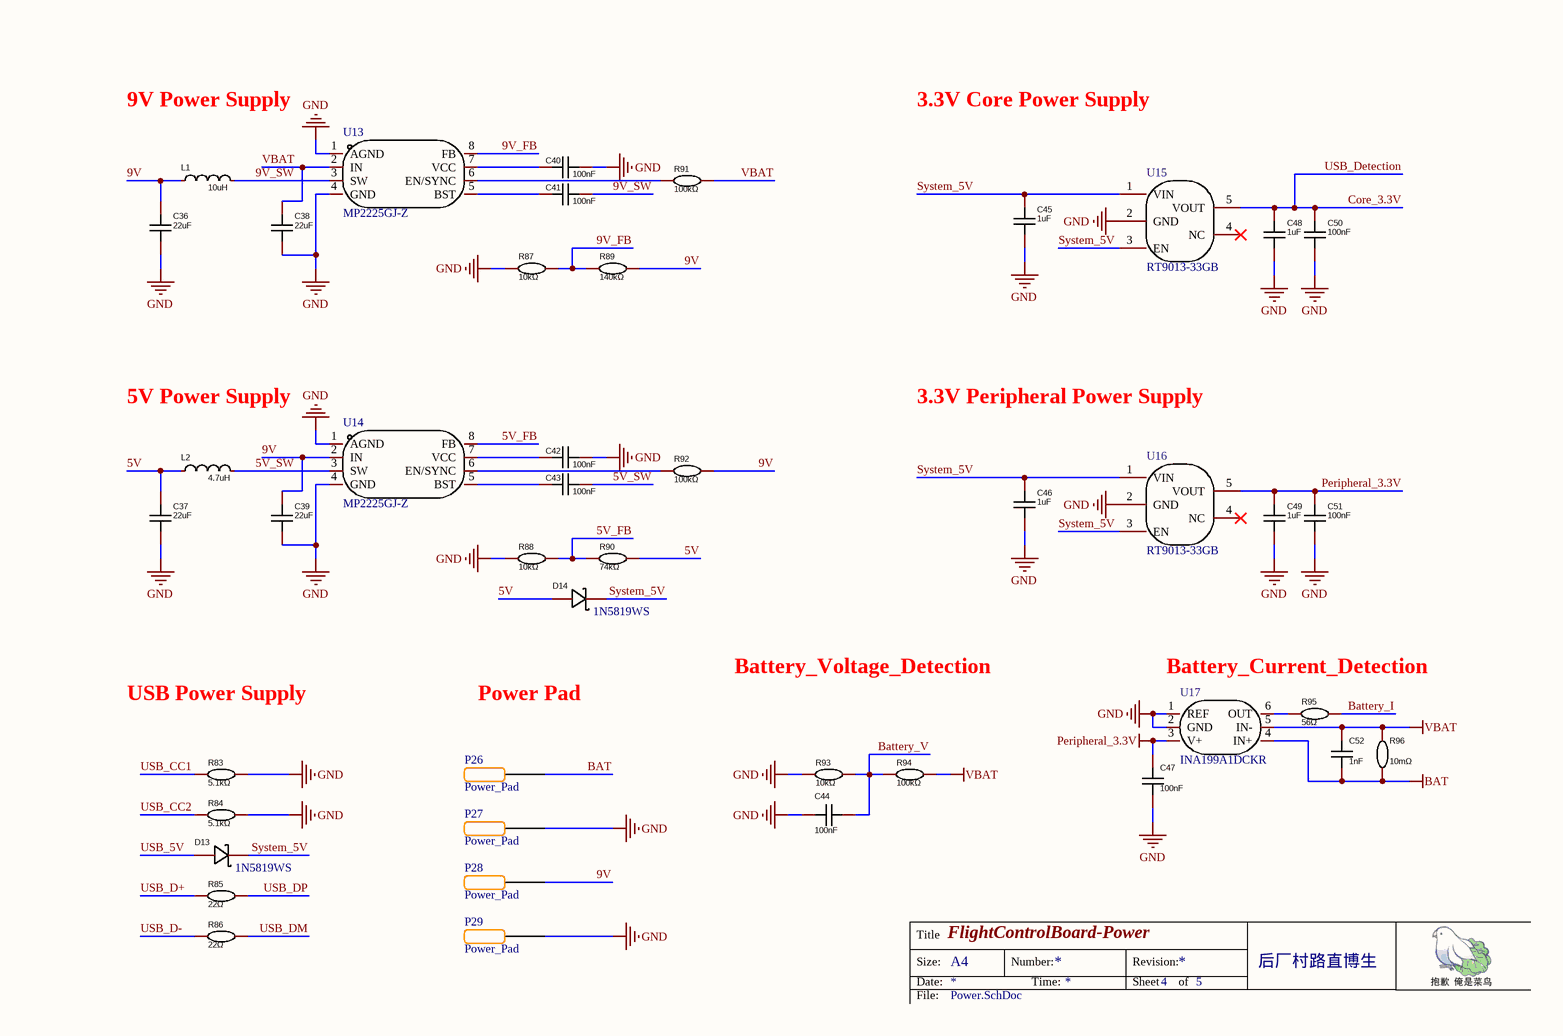
[diagram p3: Power.SchDoc]

### Parts
C36  22uF  [C0603]
C37  22uF  [C0603]
C38  22uF  [C0603]
C39  22uF  [C0603]
C40  100nF  [C0201]
C41  100nF  [C0201]
C42  100nF  [C0201]
C43  100nF  [C0201]
C44  100nF  [C0201]
C45  1uF  [C0402]
C46  1uF  [C0402]
C47  100nF  [C0201]
C48  1uF  [C0402]
C49  1uF  [C0402]
C50  100nF  [C0201]
C51  100nF  [C0201]
C52  1nF  [C0201]
D13  1N5819WS  [SOD-323]
D14  1N5819WS  [SOD-323]
L1  value 10uH  [IND-SMD_L4.0-W4.0]  (hidden comment: FHD4020S-100MT)
L2  value 4.7uH  [IND-SMD_L4.0-W4.0]  (hidden comment: FHD4020S-4R7MT)
P26  Power_Pad  [POWER HALF HOLE]
P27  Power_Pad  [POWER HALF HOLE]
P28  Power_Pad  [POWER HALF HOLE]
P29  Power_Pad  [POWER HALF HOLE]
R83  5.1kΩ  [R0201]
R84  5.1kΩ  [R0201]
R85  22Ω  [R0201]
R86  22Ω  [R0201]
R87  10kΩ  [R0201]
R88  10kΩ  [R0201]
R89  140kΩ  [R0201]
R90  74kΩ  [R0201]
R91  100kΩ  [R0201]
R92  100kΩ  [R0201]
R93  10kΩ  [R0201]
R94  100kΩ  [R0201]
R95  56Ω  [R0201]
R96  10mΩ  [R0805]
U13  MP2225GJ-Z  [SOT-23-8]
U14  MP2225GJ-Z  [SOT-23-8]
U15  RT9013-33GB  [SOT-23-5]
U16  RT9013-33GB  [SOT-23-5]
U17  INA199A1DCKR  [SOT-323-6]

### Nets
9V: C36.1 C39.1 L1.1 P28.1 R89.2 R92.2 U14.2(IN)
BAT: C52.2 P26.1 R96.1 U17.4(IN+)
Core_3.3V: C48.1 C50.1 U15.5(VOUT)  [also labelled USB_Detection]
GND: C36.2 C37.2 C38.2 C39.2 C40.1 C42.1 C44.2 C45.2 C46.2 C47.2 C48.2 C49.2 C50.2 C51.2 P27.1 P29.1 R83.1 R84.2 R87.1 R88.1 R93.1 U13.1(AGND) U13.4(GND) U14.1(AGND) U14.4(GND) U15.2(GND) U16.2(GND) U17.1(REF) U17.2(GND)
Peripheral_3.3V: C47.1 C49.1 C51.1 U16.5(VOUT) U17.3(V+)
System_5V: C45.1 C46.1 D13.1(K) D14.1(K) U15.1(VIN) U15.3(EN) U16.1(VIN) U16.3(EN)
USB_5V: D13.2(A)
VBAT: C38.1 C52.1 R91.2 R94.2 R96.2 U13.2(IN) U17.5(IN-)
5V: C37.1 D14.2(A) L2.1 R90.2
5V_FB: R88.2 R90.1 U14.8(FB)
5V_SW: C43.1 L2.2 U14.3(SW)
9V_FB: R87.2 R89.1 U13.8(FB)
9V_SW: C41.1 L1.2 U13.3(SW)
Battery_I: R95.2
Battery_V: C44.1 R93.2 R94.1
USB_CC1: R83.2
USB_CC2: R84.1
USB_D+: R85.1
USB_D-: R86.1
USB_DM: R86.2
USB_DP: R85.2
NetC40_2: C40.2 U13.7(VCC)
NetC41_2: C41.2 U13.5(BST)
NetC42_2: C42.2 U14.7(VCC)
NetC43_2: C43.2 U14.5(BST)
NetR91_1: R91.1 U13.6(EN/SYNC)
NetR92_1: R92.1 U14.6(EN/SYNC)
NetR95_1: R95.1 U17.6(OUT)

Not connected (* = marked no-connect by the designer): U15 4(NC)*; U16 4(NC)*

### Notes on the sheet
- 9V Power Supply
- 3.3V Core Power Supply
- 5V Power Supply
- 3.3V Peripheral Power Supply
- USB Power Supply
- Power Pad
- Battery_Voltage_Detection
- Battery_Current_Detection
- Title
- Size:
- Date:
- A4
- Number:
- Time:
- Revision:
- Sheet
- of
- 后厂村路直博生
- File:

### Library data of the parts
C36-C52 = CC0603KRX7R9BB104: Add into BOM: yes; Convert to PCB: yes
  C36-C39: Name: 22uF; Value: 22uF
  C40-C43 C50 C51: Name: 100nF; Value: 100nF
  C44 C47: Value: 100nF
  C45 C46 C48 C49: Name: 1uF; Value: 1uF
  C52: Value: 1nF
D13 D14 = 1N5819WS: Manufacturer: Hottech(合科泰); Device: 1N5819WS_C191023; Add into BOM: yes; Forward Voltage (Vf@If): 600mV@1A; Reverse Voltage (Vr): 40V; Average Rectified Current (Io): 1A; Symbol: 1N5819WS; Supplier: LCSC; Supplier Part: C191023; Manufacturer Part: 1N5819WS; JLCPCB Part Class: Basic Part; LCSC Part Name: 电压:40V 电流:1A; Supplier Footprint: SOD-323; Datasheet: https://atta.szlcsc.com/upload/public/pdf/source/20220428/3CB86FD8D28D653594B4E35F9D5AEFD9.pdf; Convert to PCB: yes
L1 L2 = SDFL2012T220KTF: Manufacturer: cjiang(长江微电); Add into BOM: yes; Tolerance: ±10%; Rated Current: 5mA; DC Resistance (DCR): 1.1Ω; Supplier Footprint: SMD,4x4mm; JLCPCB Part Class: Basic Part; Datasheet: https://atta.szlcsc.com/upload/public/pdf/source/20210816/855F4348312D259031B87CBCF31BE802.pdf; Supplier: LCSC; Convert to PCB: yes; Saturation Current (Isat): -; Q @ Freq: -; Frequency - Self Resonant: -; Ratings: -
  L1: Name: 10uH; Symbol: FHD4020S-100MT; Device: FHD4020S-100MT; LCSC Part Name: 10uH ±20% 3.5A; Supplier Part: C602032; Manufacturer Part: FHD4020S-100MT
  L2: Name: 4.7uH; Symbol: FHD4020S-4R7MT; Device: FHD4020S-4R7MT; LCSC Part Name: 4.7uH ±20% 4.9A; Supplier Part: C602031; Manufacturer Part: FHD4020S-4R7MT
R83-R96 = 0603WAF1002T5E: Add into BOM: yes; Convert to PCB: yes
  R83 R84: Name: 5.1kΩ; Value: 5.1kΩ
  R85 R86: Name: 22Ω; Value: 22Ω
  R87 R88 R93: Name: 10kΩ; Value: 10kΩ
  R89: Name: 140kΩ; Value: 140kΩ
  R90: Name: 74kΩ; Value: 74kΩ
  R91 R92 R94: Name: 100kΩ; Value: 100kΩ
  R95: Name: 56Ω; Value: 56Ω
  R96: Name: 10mΩ; Value: 10mΩ; Supplier Part: C163089
U13 U14 = MP2225GJ-Z: Symbol: MP2225GJ-Z_C9900010483; Add into BOM: yes; Device: MP2225GJ-Z; LCSC Part Name: MP2225GJ-Z; Supplier Part: C9900010483; Manufacturer Part: MP2225GJ-Z; Supplier Footprint: SOT23-8M; JLCPCB Part Class: 扩展库; Datasheet: https://atta.szlcsc.comnull; Supplier: LCSC; Convert to PCB: yes
U15 U16 = RT9013-33GB: Manufacturer: RICHTEK(立锜); Add into BOM: yes; Output Type: 固定; Output Polarity: 正; Number of Outputs: 1; Maximum Input Voltage: 5.5V; Output Voltage: 3.3V; Dropout Voltage: 400mV@(500mA); Quiescent Current (Ground Current): 50uA; Output Current: 500mA; Power Supply Rejection Ratio (PSRR): 50dB@(10kHz); Name: RT9013-33GB; Symbol: RT9013-33GB; Device: RT9013-33GB; LCSC Part Name: 输入5.5V 输出3.3V 500mA; Supplier Part: C47773; Manufacturer Part: RT9013-33GB; Supplier Footprint: SOT-23-5; JLCPCB Part Class: Extended Part; Datasheet: https://atta.szlcsc.com/upload/public/pdf/source/20150504/1457707282459.pdf; Supplier: LCSC; Convert to PCB: yes; Noise: -; Feature: -; Operating Temperature: -40℃~+85℃
U17 = INA199A1DCKR: Manufacturer: TI(德州仪器); Add into BOM: yes; Supply Current: 300uA; Supply Voltage: -300mV~26V; Name: INA199A1DCKR; Symbol: INA199A1DCKR; Device: INA199A1DCKR; LCSC Part Name: INA199A1DCKR; Supplier Part: C59135; Manufacturer Part: INA199A1DCKR; Supplier Footprint: SOT-323-6; JLCPCB Part Class: Extended Part; Datasheet: https://www.ti.com/cn/lit/gpn/ina199; Supplier: LCSC; Convert to PCB: yes; Operating Temperature: -40℃~+125℃

## Sheet Interface.SchDoc: FlightControlBoard-Interface
size A4; SheetNumber: 5; SheetTotal: 5
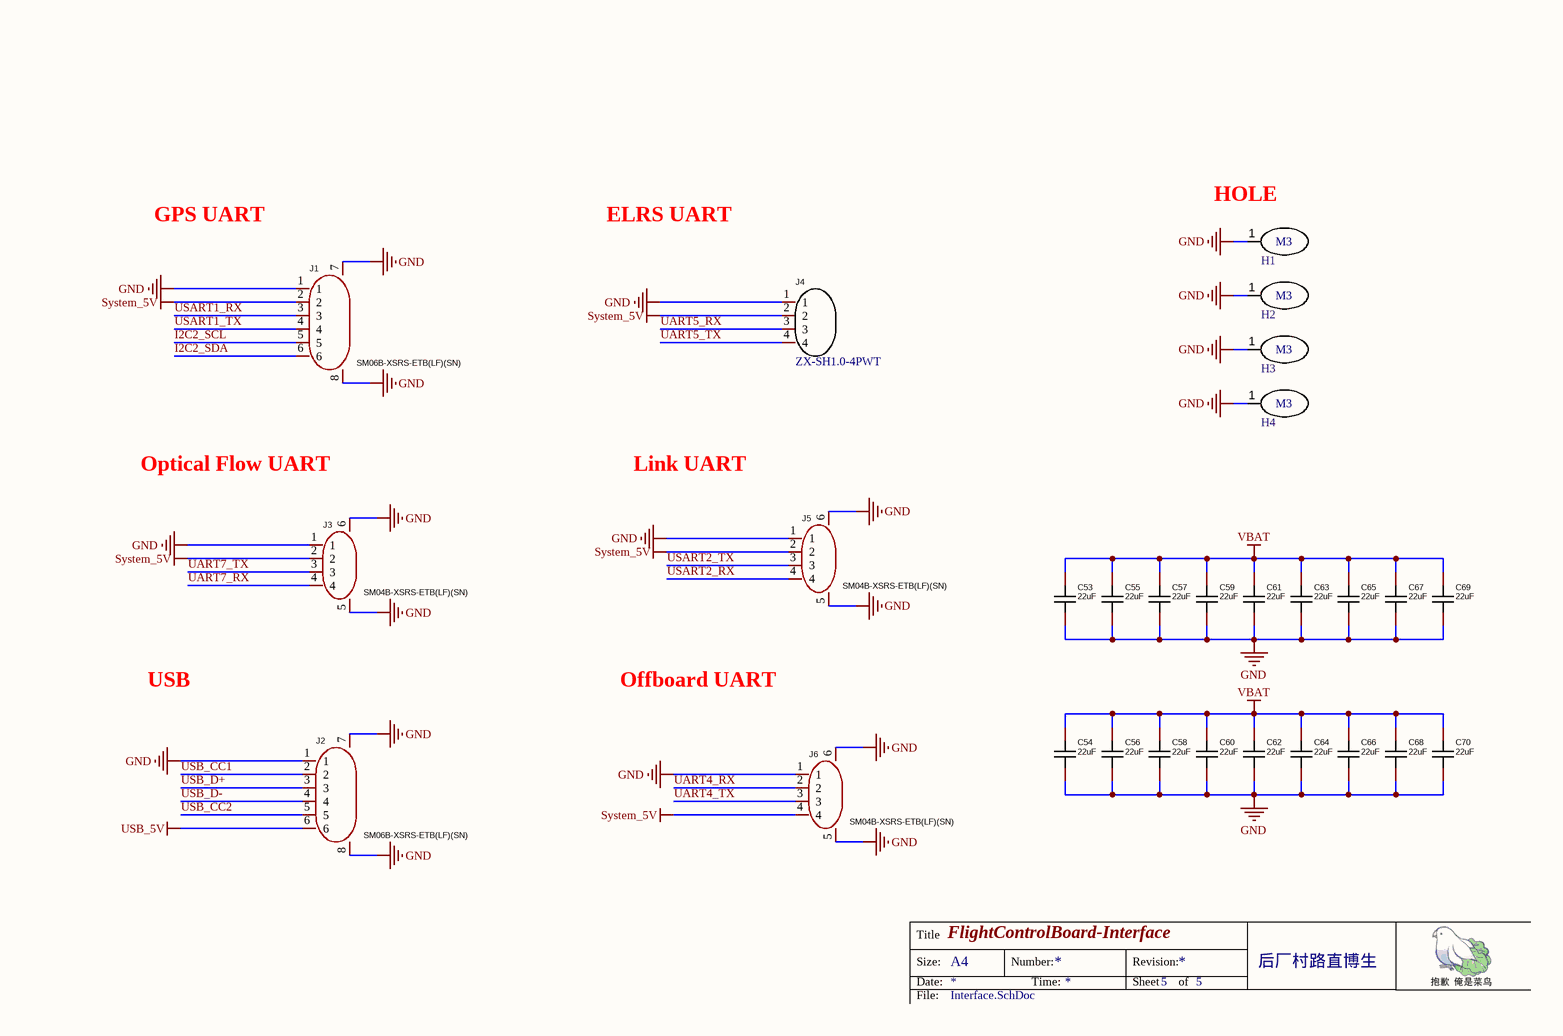
[diagram p4: Interface.SchDoc]

### Parts
C53  22uF  [C0805]
C54  22uF  [C0805]
C55  22uF  [C0805]
C56  22uF  [C0805]
C57  22uF  [C0805]
C58  22uF  [C0805]
C59  22uF  [C0805]
C60  22uF  [C0805]
C61  22uF  [C0805]
C62  22uF  [C0805]
C63  22uF  [C0805]
C64  22uF  [C0805]
C65  22uF  [C0805]
C66  22uF  [C0805]
C67  22uF  [C0805]
C68  22uF  [C0805]
C69  22uF  [C0805]
C70  22uF  [C0805]
H1  M3_HOLE  [M3_HOLE]  (value not drawn)
H2  M3_HOLE  [M3_HOLE]  (value not drawn)
H3  M3_HOLE  [M3_HOLE]  (value not drawn)
H4  M3_HOLE  [M3_HOLE]  (value not drawn)
J1  SM06B-XSRS-ETB(LF)(SN)  [CONN-SMD_6P-P0.6]
J2  SM06B-XSRS-ETB(LF)(SN)  [CONN-SMD_6P-P0.6]
J3  SM04B-XSRS-ETB(LF)(SN)  [CONN-SMD_4P-P0.6]
J4  ZX-SH1.0-4PWT  [ELRSPad]
J5  SM04B-XSRS-ETB(LF)(SN)  [CONN-SMD_4P-P0.6]
J6  SM04B-XSRS-ETB(LF)(SN)  [CONN-SMD_4P-P0.6]

### Nets
GND: C53.2 C54.2 C55.2 C56.2 C57.2 C58.2 C59.2 C60.2 C61.2 C62.2 C63.2 C64.2 C65.2 C66.2 C67.2 C68.2 C69.2 C70.2 H1.1 H2.1 H3.1 H4.1 J1.1 J1.7 J1.8 J2.1 J2.7 J2.8 J3.1 J3.5 J3.6 J4.1 J5.1 J5.5 J5.6 J6.1 J6.5 J6.6
System_5V: J1.2 J3.2 J4.2 J5.2 J6.4
USB_5V: J2.6
VBAT: C53.1 C54.1 C55.1 C56.1 C57.1 C58.1 C59.1 C60.1 C61.1 C62.1 C63.1 C64.1 C65.1 C66.1 C67.1 C68.1 C69.1 C70.1
I2C2_SCL: J1.5
I2C2_SDA: J1.6
UART4_RX: J6.2
UART4_TX: J6.3
UART5_RX: J4.3
UART5_TX: J4.4
UART7_RX: J3.4
UART7_TX: J3.3
USART1_RX: J1.3
USART1_TX: J1.4
USART2_RX: J5.4
USART2_TX: J5.3
USB_CC1: J2.2
USB_CC2: J2.5
USB_D+: J2.3
USB_D-: J2.4

### Notes on the sheet
- GPS UART
- ELRS UART
- (near H1) HOLE
- Optical Flow UART
- Link UART
- USB
- Offboard UART
- Title
- Size:
- Date:
- A4
- Number:
- Time:
- Revision:
- Sheet
- of
- 后厂村路直博生
- File:
- (in symbol M3_HOLE) M3

### Library data of the parts
C53-C70 = CC0603KRX7R9BB104: Add into BOM: yes; Convert to PCB: yes; Value: 22uF
J1 J2 = SM06B-XSRS-ETB(LF)(SN): Manufacturer: JST; Add into BOM: yes; Pitch: 0.6mm; Current Rating (Max): 200mA; Symbol: SM06B-XSRS-ETB(LF)(SN); Device: SM06B-XSRS-ETB(LF)(SN); LCSC Part Name: SM06B-XSRS-ETB(LF)(SN); Supplier Part: C5306600; Manufacturer Part: SM06B-XSRS-ETB(LF)(SN); Supplier Footprint: SMD,P=0.6mm,卧贴; JLCPCB Part Class: Extended Part; Datasheet: https://atta.szlcsc.com/upload/public/pdf/source/20211104/F92F039D0CBA277DB4B3F7158FB08335.pdf; Supplier: LCSC; Convert to PCB: yes; Mounting Style: 卧贴; Number of Rows: 1; Contact Material: 铜合金; Contact Plating: 锡; Operating Temperature Range: -25℃~+85℃
J3 J5 J6 = SM04B-XSRS-ETB(LF)(SN): Manufacturer: JST; Add into BOM: yes; Symbol: SM04B-XSRS-ETB(LF)(SN); Device: SM04B-XSRS-ETB(LF)(SN); LCSC Part Name: SM04B-XSRS-ETB(LF)(SN); Supplier Part: C5223639; Manufacturer Part: SM04B-XSRS-ETB(LF)(SN); Supplier Footprint: SMD; JLCPCB Part Class: Extended Part; Datasheet: https://atta.szlcsc.com/upload/public/pdf/source/20231218/E491C8E1E509E6459DF900917B8E5F93.pdf; Supplier: LCSC; Convert to PCB: yes
J4 = ELRSPad

## Nets that join several sheets
9V: ESC (20 pins), Power (7 pins)
Core_3.3V: MCU (18 pins), Peripheral (22 pins), Power (C48.1 C50.1 U15.5)
GND: MCU (16 pins), ESC (76 pins), Peripheral (23 pins), Power (29 pins), Interface (38 pins)
Peripheral_3.3V: ESC (12 pins), Peripheral (C33.2 SD1.4), Power (5 pins)
System_5V: Power (8 pins), Interface (5 pins)
USB_5V: Power (D13.2), Interface (J2.6)
VBAT: ESC (48 pins), Power (7 pins), Interface (18 pins)
Battery_I: MCU (U1.H4), Power (R95.2)
Battery_V: MCU (U1.G4), Power (C44.1 R93.2 R94.1)
I2C1_Data_Ready: MCU (U1.A5), Peripheral (U12.7)
I2C1_SCL: MCU (U1.B4), Peripheral (R75.1 U12.2)
I2C1_SDA: MCU (U1.A4), Peripheral (R74.1 U12.4)
I2C2_SCL: MCU (U1.J7), Peripheral (R77.1), Interface (J1.5)
I2C2_SDA: MCU (U1.K7), Peripheral (R76.1), Interface (J1.6)
M1_PWM: MCU (U1.K10), ESC (R10.2)
M2_PWM: MCU (U1.J10), ESC (R11.2)
M3_PWM: MCU (U1.H8), ESC (R12.2)
M4_PWM: MCU (U1.G8), ESC (R13.2)
SDMMC_CK: MCU (U1.C8), Peripheral (SD1.5)
SDMMC_CMD: MCU (U1.B7), Peripheral (R82.1 SD1.3)
SDMMC_D0: MCU (U1.F9), Peripheral (R78.1 SD1.7)
SDMMC_D1: MCU (U1.E9), Peripheral (R79.1 SD1.8)
SDMMC_D2: MCU (U1.B9), Peripheral (R80.1 SD1.1)
SDMMC_D3: MCU (U1.B8), Peripheral (R81.1 SD1.2)
SPI2_Accel_CS: MCU (U1.F3), Peripheral (U10.14)
SPI2_Accel_Data_Ready: MCU (U1.C3), Peripheral (U10.16)
SPI2_Gyro_CS: MCU (U1.A2), Peripheral (U10.5)
SPI2_Gyro_Data_Ready: MCU (U1.B3), Peripheral (U10.12)
SPI2_MISO: MCU (U1.E2), Peripheral (U10.10 U10.15)
SPI2_MOSI: MCU (U1.F2), Peripheral (U10.9)
SPI2_SCK: MCU (U1.C7), Peripheral (U10.8)
SPI4_Accel_CS: MCU (U1.D7), Peripheral (U11.14)
SPI4_Accel_Data_Ready: MCU (U1.C6), Peripheral (U11.16)
SPI4_Gyro_CS: MCU (U1.B5), Peripheral (U11.5)
SPI4_Gyro_Data_Ready: MCU (U1.B6), Peripheral (U11.12)
SPI4_MISO: MCU (U1.D3), Peripheral (U11.10 U11.15)
SPI4_MOSI: MCU (U1.E3), Peripheral (U11.9)
SPI4_SCK: MCU (U1.A3), Peripheral (U11.8)
UART4_RX: MCU (U1.D8), Interface (J6.2)
UART4_TX: MCU (U1.E8), Interface (J6.3)
UART5_RX: MCU (U1.K8), Interface (J4.3)
UART5_TX: MCU (U1.J8), Interface (J4.4)
UART7_RX: MCU (U1.H5), Interface (J3.4)
UART7_TX: MCU (U1.J5), Interface (J3.3)
USART1_RX: MCU (U1.D10), Interface (J1.3)
USART1_TX: MCU (U1.C9), Interface (J1.4)
USART2_RX: MCU (U1.K2), Interface (J5.4)
USART2_TX: MCU (U1.J2), Interface (J5.3)
USB_CC1: Power (R83.2), Interface (J2.2)
USB_CC2: Power (R84.1), Interface (J2.5)
USB_D+: Power (R85.1), Interface (J2.3)
USB_D-: Power (R86.1), Interface (J2.4)
USB_DM: MCU (U1.C10), Power (R86.2)
USB_DP: MCU (U1.B10), Power (R85.2)